# Altium schematic sheet HLK-LD-KIT-V2.0.SchDoc
size A3
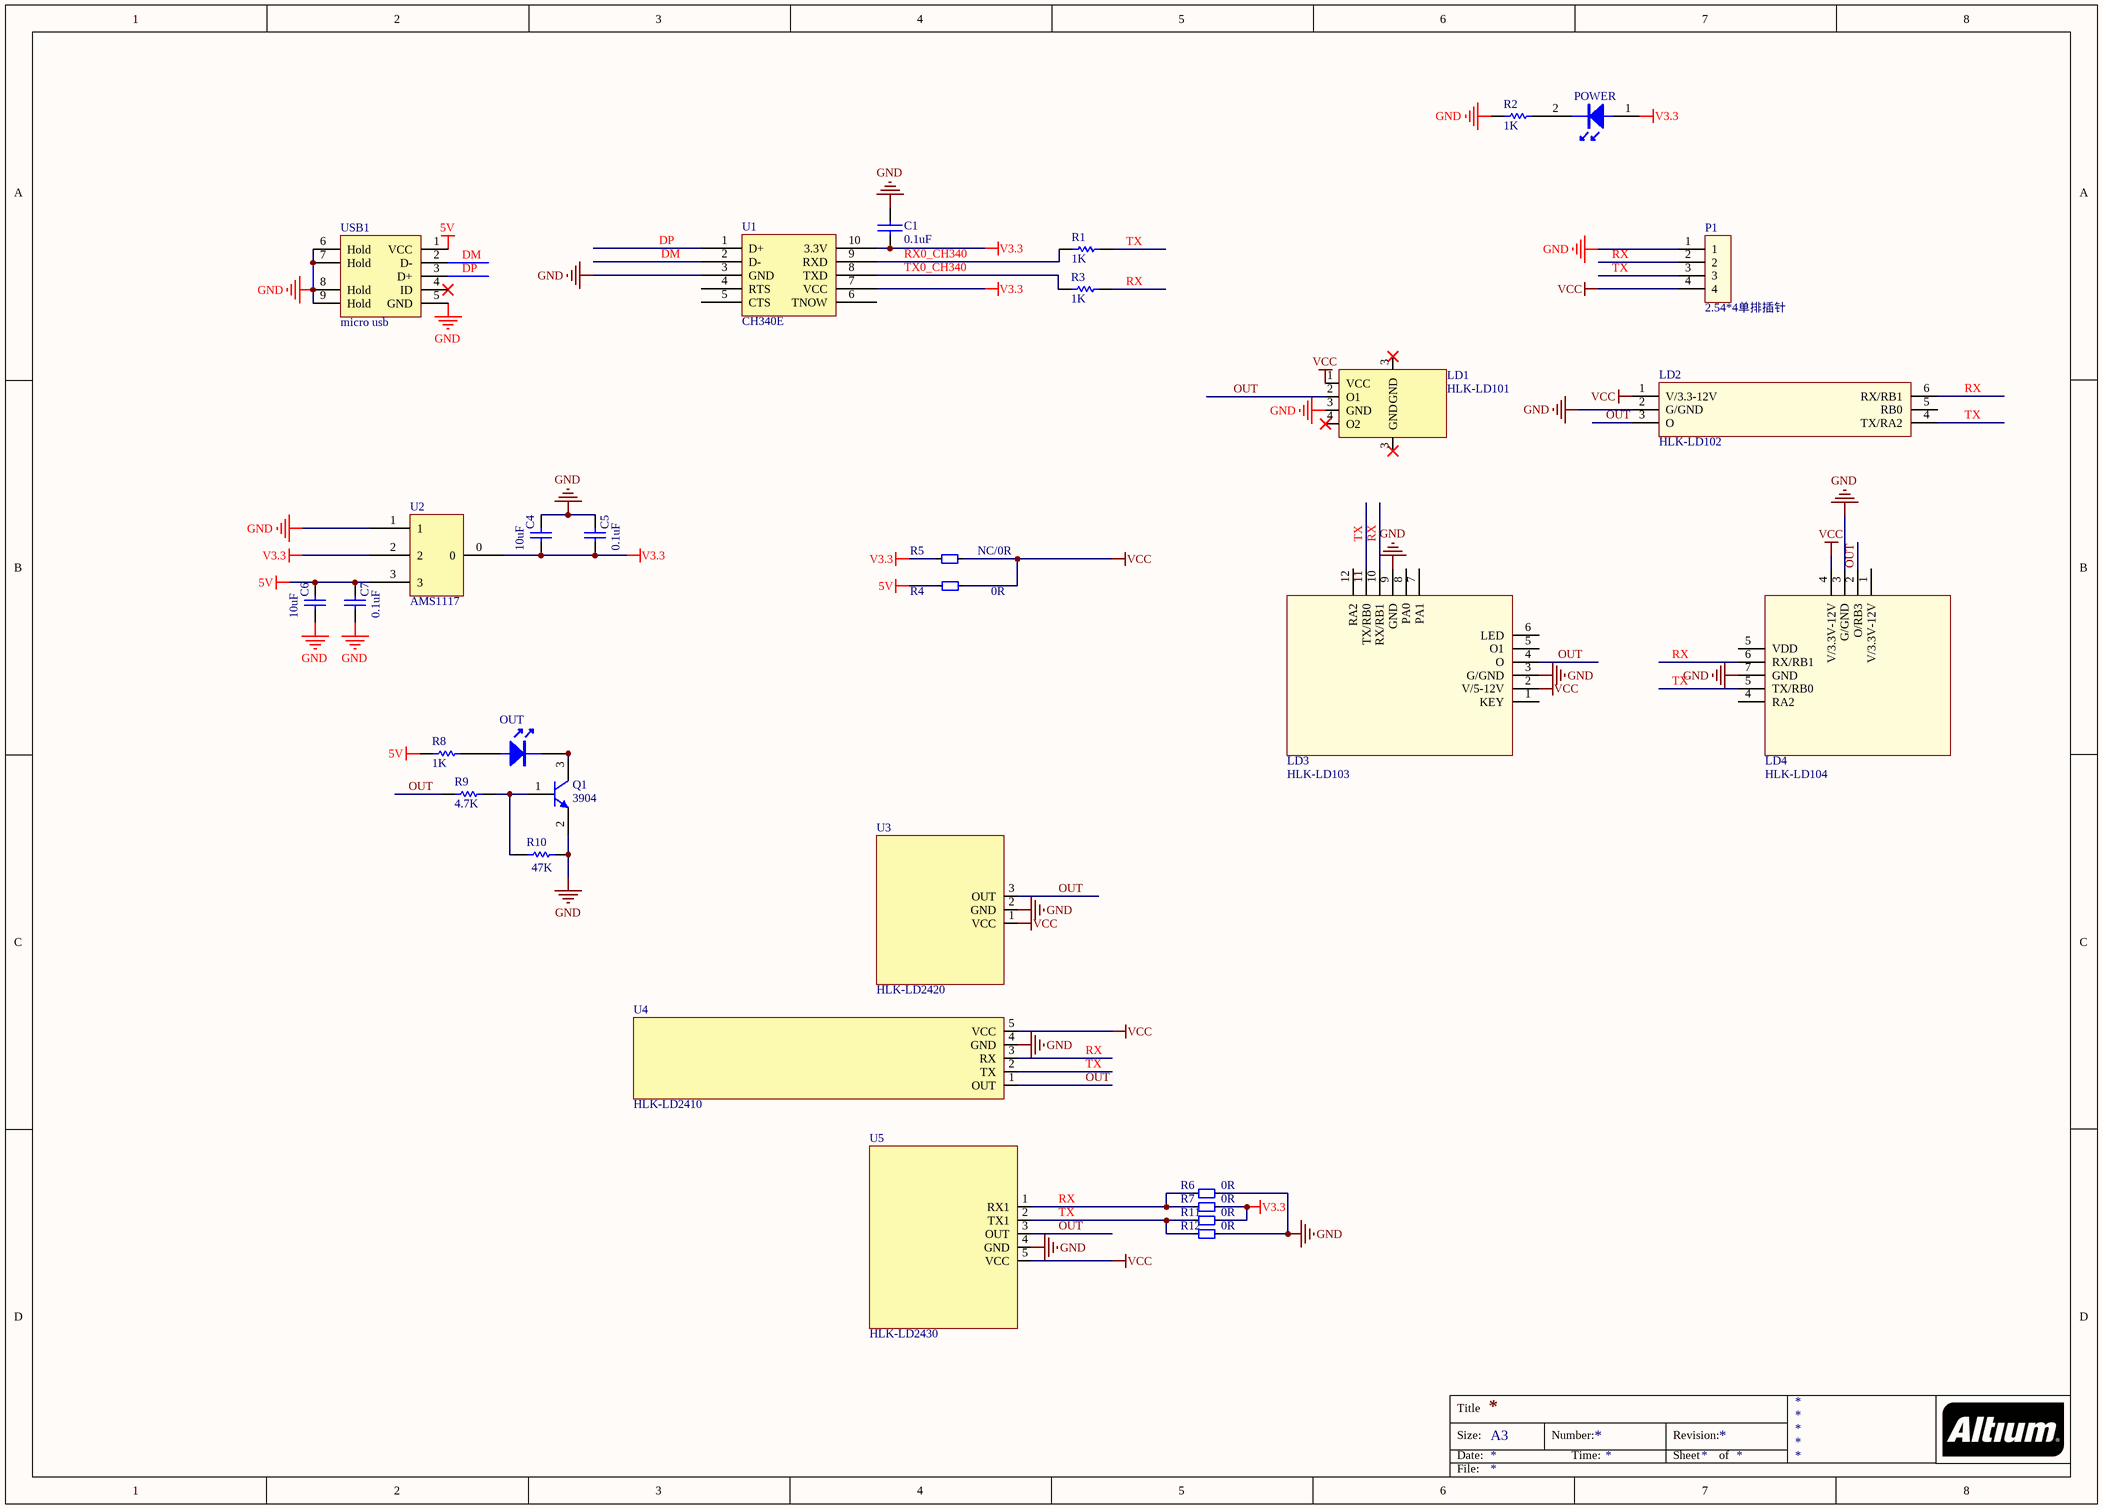
[diagram p0: HLK-LD-KIT-V2.0.SchDoc]

## Parts
C1  0.1uF  [0603]
C4  10uF  [0603]
C5  0.1uF  [0603]
C6  10uF  [0603]
C7  0.1uF  [0603]
LD1  HLK-LD101  [LD101]
LD2  HLK-LD102  [LD102]
LD3  HLK-LD103  [LD103]
LD4  HLK-LD104  [LD104]
OUT  (no value)  [0603LED]
P1  2.54*4单排插针  [SIP_4P_2.54]
POWER  LED  [0603LED]  (value not drawn)
Q1  3904  [SOT-23]
R1  1K  [0603]
R2  1K  [0603]
R3  1K  [0603]
R4  0R  [R0603]
R5  NC/0R  [R0603]
R6  0R  [R0603]
R7  0R  [R0603]
R8  1K  [0603]
R9  4.7K  [0603]
R10  47K  [0603]
R11  0R  [R0603]
R12  0R  [R0603]
U1  CH340E  [MSOP-10]
U2  AMS1117  [1117]
U3  HLK-LD2420  [HLK-LD2420]
U4  HLK-LD2410  [HLK-LD2410]
U5  HLK-LD2430  [HLK-LD2430]
USB1  micro usb  [USB-MICRO_D]

## Nets
5V: C6.1 C7.1 R4.2 R8.1 U2.3 USB1.1(VCC)
GND: C1.1 C4.1 C5.1 C6.2 C7.2 LD1.3(GND) LD2.2(G/GND) LD3.3(G/GND) LD3.9(GND) LD4.3(G/GND) LD4.7(GND) P1.1 Q1.2(E) R2.2 R6.1 R10.1 R12.1 U1.3(GND) U2.1 U3.2(GND) U4.4(GND) U5.4(GND) USB1.5(GND) USB1.6(Hold) USB1.7(Hold) USB1.8(Hold) USB1.9(Hold)
V3.3: C1.2 C4.2 C5.2 POWER.1 R5.2 R7.1 R11.1 U1.7(VCC) U1.10(3.3V) U2.0 U2.2
VCC: LD1.1(VCC) LD2.1(V/3.3-12V) LD3.2(V/5-12V) LD4.4(RA2) P1.4 R4.1 R5.1 U3.1(VCC) U4.5(VCC) U5.5(VCC)
DM: U1.2(D-) USB1.2(D-)
DP: U1.1(D+) USB1.3(D+)
OUT: LD1.2(O1) LD2.3(O) LD3.4(O) LD4.2(O/RB3) R9.2 U3.3(OUT) U4.1(OUT) U5.3(OUT)
RX: LD2.6(RX/RB1) LD3.10(RX/RB1) LD4.6(RX/RB1) P1.2 R3.1 R6.2 R7.2 U4.3(RX) U5.1(RX1)
RX0_CH340: R1.2 U1.9(RXD)
TX: LD2.4(TX/RA2) LD3.11(TX/RB0) LD4.5(TX/RB0) P1.3 R1.1 R11.2 R12.2 U4.2(TX) U5.2(TX1)
TX0_CH340: R3.2 U1.8(TXD)
NetOUT_1: OUT.1 R8.2
NetOUT_2: OUT.2 Q1.3(C)
NetPOWER_2: POWER.2 R2.1
NetQ1_1: Q1.1(B) R9.1 R10.2

Not connected (* = marked no-connect by the designer): LD1 4(O2)*; LD2 5(RB0); LD3 1(KEY) 5(O1) 6(LED) 7(PA1) 8(PA0) 12(RA2); LD4 1(V/3.3V-12V); U1 4(RTS) 5(CTS) 6(TNOW); USB1 4(ID)*

## Notes on the sheet
- Title
- Size:
- Date:
- A3
- Number:
- Time:
- Revision:
- Sheet
- of
- File:

## Library data of the parts
C1 = CAP: Capacitor
C4-C7 = Cap: Capacitor; Value: 100pF; Published: 8-Jun-2000; LatestRevisionDate: 17-Jul-2002; LatestRevisionNote: Re-released for DXP Platform.; PackageReference: RAD-0.3; Publisher: Altium Limited
LD1 = LD101
LD2-LD4 = HLK-LD015-5G
OUT = LED
P1 = 2.54*2插针
Q1 = A09T: NPN General Purpose Amplifier; Published: 8-Jun-2000; LatestRevisionDate: 15-Jan-2003; LatestRevisionNote: PCB Footprint 'BCY-W3/D4.7' replaced; DatasheetDocument: 1997; PackageDocument: Sep-1998; PackageReference: TO-92A; Publisher: Altium Limited; Code_JEDEC: TO-92A; ComponentLink1Description: Manufacturer Link; ComponentLink1URL: http://www.fairchildsemi.com/; ComponentLink2Description: Datasheet; ComponentLink2URL: http://www.fairchildsemi.com/ds/2N%2F2N3904.pdf
R1-R3 R8-R10 = Res1: Resistor; Published: 8-Jun-2000; LatestRevisionDate: 17-Jul-2002; LatestRevisionNote: Re-released for DXP Platform.; PackageReference: AXIAL-0.3; Publisher: Altium Limited
  R1-R3 R8: Value: 1K
  R9: Value: 4.7K
  R10: Value: 47K
R4-R7 R11 R12 = R
U2 = Component_1
U3 = HLK-LD2420: 生命存在24G雷达
U4 = HLK-LD2410: 生命存在24G雷达
U5 = HLK-LD2430: 生命存在24G雷达
USB1 = USB-D